# EAGLE schematic kamstrup-wifi (EAGLE 8.1.1)
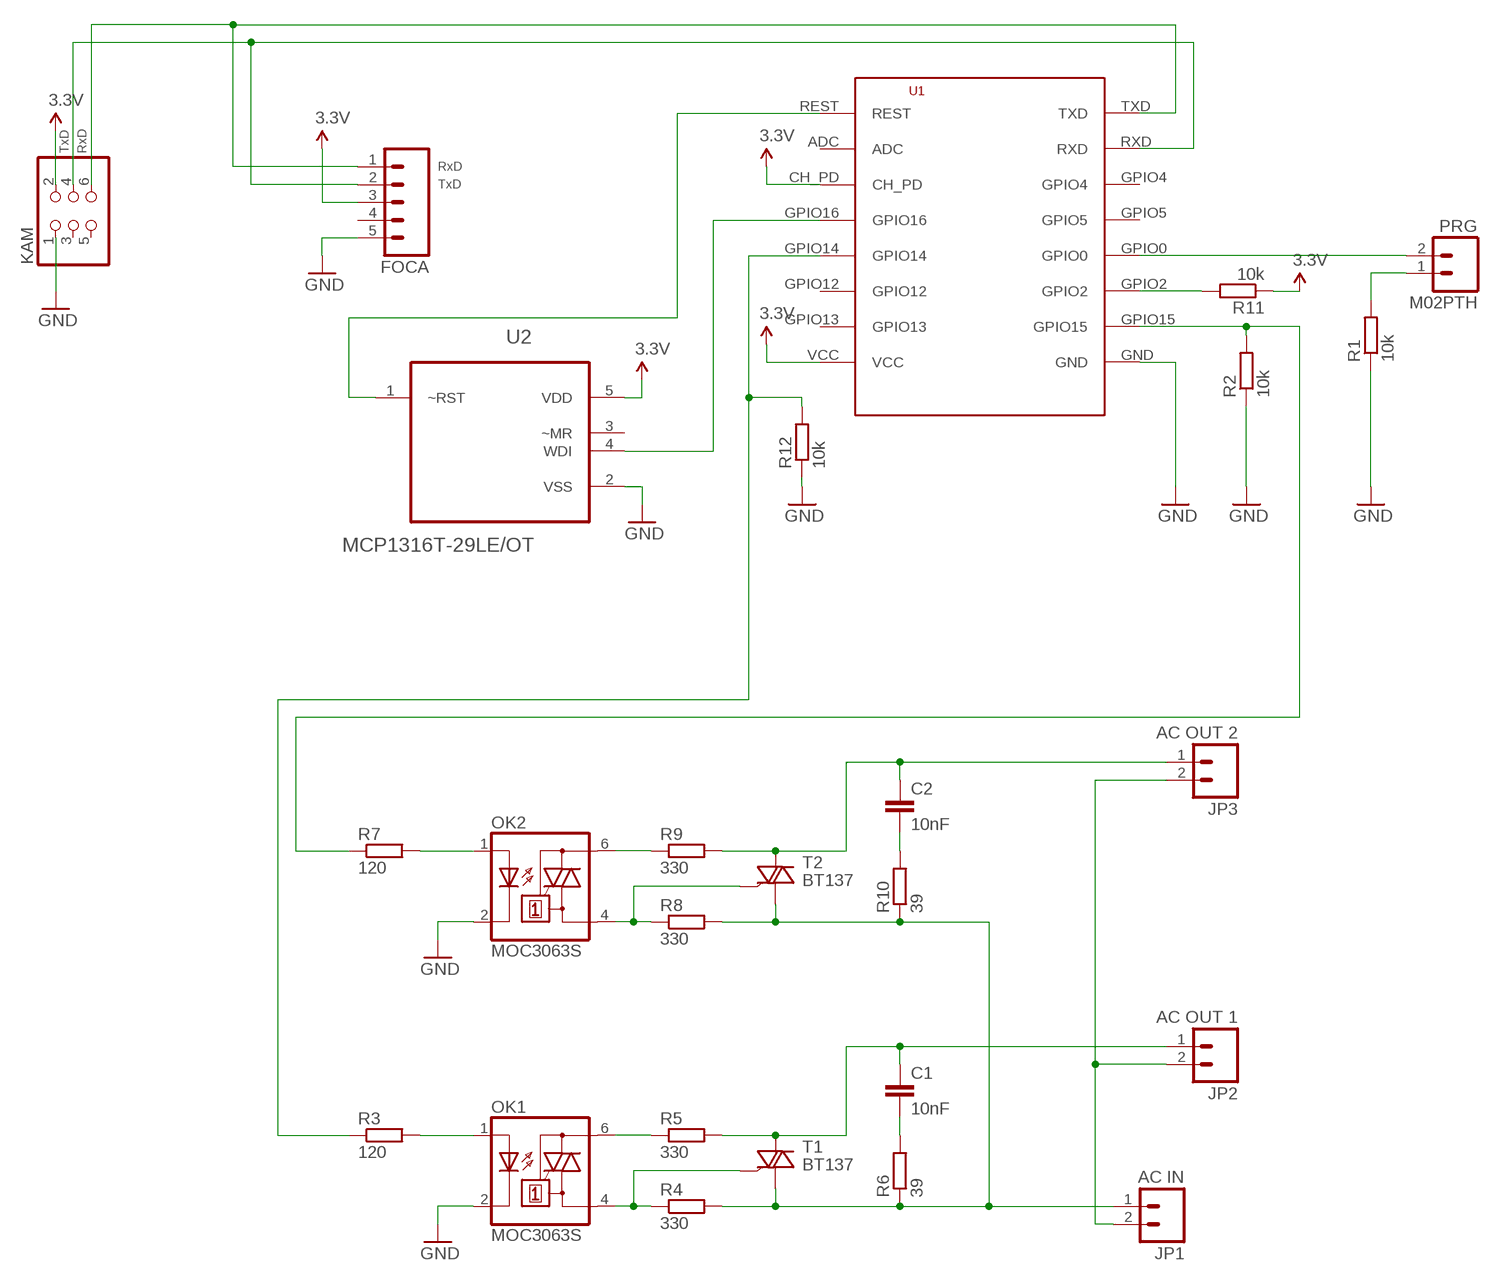
[diagram p0: schematic, sheet 1]

## Parts
C1  10nF  C-EUC1206  [C1206]
C2  10nF  C-EUC1206  [C1206]
FOCA  M05PTH  [1X05]
JP1  AC IN  M025MM  [SCREWTERMINAL-5MM-2]
JP2  AC OUT 1  M025MM  [SCREWTERMINAL-5MM-2]
JP3  AC OUT 2  M025MM  [SCREWTERMINAL-5MM-2]
KAM  PINHD-2X3  [2X03]
OK1  MOC3063S  MOC3043S  [DIL6-SMD]
OK2  MOC3063S  MOC3043S  [DIL6-SMD]
PRG  M02PTH  [1X02]
R1  10k  R-EU_R0805  [R0805]
R2  10k  R-EU_R0805  [R0805]
R3  120  R-EU_R0805  [R0805]
R4  330  R-EU_R0805  [R0805]
R5  330  R-EU_R0805  [R0805]
R6  39  R-EU_R0805  [R0805]
R7  120  R-EU_R0805  [R0805]
R8  330  R-EU_R0805  [R0805]
R9  330  R-EU_R0805  [R0805]
R10  39  R-EU_R0805  [R0805]
R11  10k  R-EU_R0805  [R0805]
R12  10k  R-EU_R0805  [R0805]
T1  BT137  [SOT428]
T2  BT137  [SOT428]
U1  ESP8266-07  [ESP-07]
U2  MCP1316T-29LE/OT  [SOT95P270X145-5N]

## Nets
3.3V: FOCA.3 KAM.2 R11.1 U1.CH_PD U1.VCC U2.5(VDD)
GND: FOCA.5 KAM.1 OK1.2(C) OK2.2(C) R1.1 R2.1 R12.1 U1.GND U2.2(VSS)
N$1: FOCA.1 KAM.6 U1.TXD
N$2: FOCA.2 KAM.4 U1.RXD
N$3: PRG.2 U1.GPIO0
N$4: PRG.1 R1.2
N$5: OK2.1(A) R7.2
N$6: OK2.4(A1) R8.1 T2.3(G)
N$7: OK2.6(A2) R9.1
N$8: C2.1 JP3.1 R9.2 T2.4(A2)
N$9: JP1.1 R4.2 R6.1 R8.2 R10.1 T1.1(A1) T2.1(A1)
N$10: C2.2 R10.2
N$11: R3.1 R12.2 U1.GPIO14
N$12: OK1.1(A) R3.2
N$13: OK1.4(A1) R4.1 T1.3(G)
N$14: OK1.6(A2) R5.1
N$15: C1.1 JP2.1 R5.2 T1.4(A2)
N$16: R2.2 R7.1 U1.GPIO15
N$17: C1.2 R6.2
N$18: JP1.2 JP2.2 JP3.2
N$19: U1.REST U2.1(~RST)
N$20: U1.GPIO16 U2.4(WDI)
N$21: R11.2 U1.GPIO2
Unconnected: FOCA.4 KAM.3 KAM.5 U1.ADC U1.GPIO4 U1.GPIO5 U1.GPIO12 U1.GPIO13 U2.3(~MR)

## Notes on the sheet
- TxD | RxD
- RxD
- TxD

## Library data of the parts
C1 C2 = rcl:C-EU: CAPACITOR, European symbol
FOCA = SparkFun-Connectors:M05: Header 5 Standard 5-pin 0.1" header. Use with straight break away headers (SKU : PRT-00116), right angle break away headers (PRT-00553), swiss pins (PRT-00743), machine pins (PRT-00117), and female headers (PRT-00115). Molex polarized connector foot print use with SKU : PRT-08230 with associated crimp pins and housings.
JP1-JP3 = TE Terminal Block 45 degrees:M02: Standard 2-pin 0.1" header. Use with - straight break away headers ( PRT-00116) - right angle break away headers (PRT-00553) - swiss pins (PRT-00743) - machine pins (PRT-00117) - female headers (PRT-00115) Molex polarized connector foot print use with: PRT-08233 with associated crimp pins and housings. 2.54_SCREWTERM for use with PRT-10571. 3.5mm Screw Terminal footprints for PRT-08084 5mm Screw Terminal footprints for use with PRT-08433
KAM = SparkFun-Connectors:PINHD-2X3: PIN HEADER
OK1 OK2 = optocoupler:MOC30*: 6-Pin DIP Zero-Cross Optoisolators Triac Driver Output (250/400 Volt Peak) Source: Data sheet <http://www.fairchildsemi.com/ds/MO/MOC3031M.pdf> The old path of data sheet not more available 2013-05-06.; MF: FAIRCHILD SEMICONDUCTOR; MPN: MOC3043SM; OC_FARNELL: 1505441; OC_NEWARK: 78K6091
PRG = SparkFun-Connectors:M02: Standard 2-pin 0.1" header. Use with - straight break away headers ( PRT-00116) - right angle break away headers (PRT-00553) - swiss pins (PRT-00743) - machine pins (PRT-00117) - female headers (PRT-00115) Molex polarized connector foot print use with: PRT-08233 with associated crimp pins and housings. 2.54_SCREWTERM for use with PRT-10571. 3.5mm Screw Terminal footprints for PRT-08084 5mm Screw Terminal footprints for use with PRT-08433
R1-R12 = rcl:R-EU_: RESISTOR, European symbol
T1 T2 = Triac SOT428:BT137: Triac BT137 series E sensitive gate Source: http://docs-europe.electrocomponents.com/webdocs/1270/0900766b81270fce.pdf
U1 = lio:ESP8266
U2 = Microchip_By_element14_Batch_1:MCP1316T-29LE/OT: Voltage Supervisor; MPN: MCP1316T-29LE/OT; OC_FARNELL: 1332071; OC_NEWARK: 34M7402; PACKAGE: SOT-5; SUPPLIER: Microchip